# Altium schematic sheet Buck Converter.SchDoc
size A; SheetNumber: 4; SheetTotal: 5
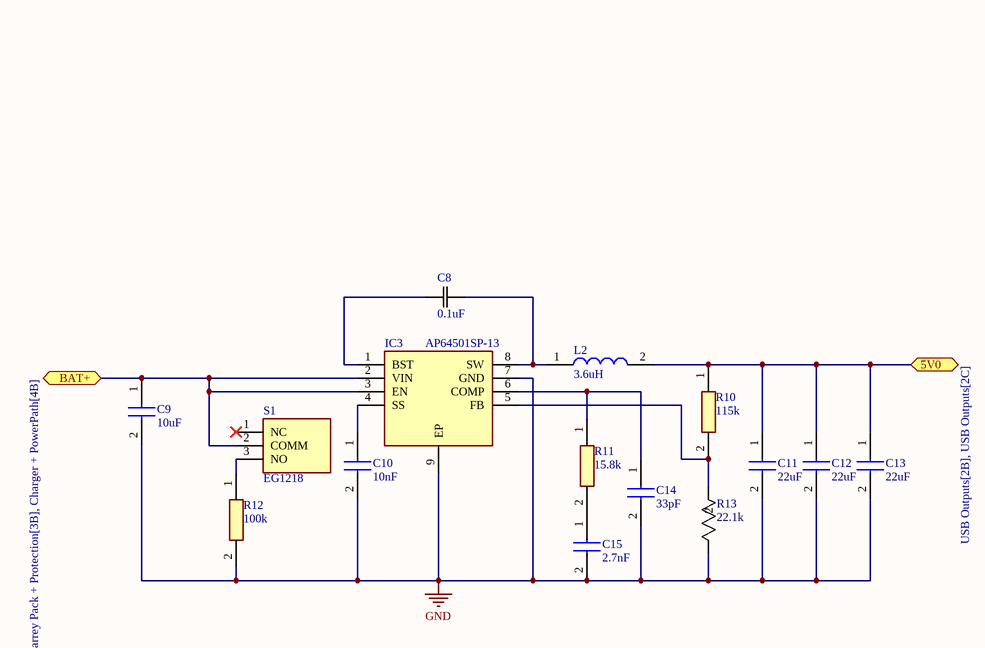
[diagram p0: Buck Converter.SchDoc]

## Parts
C8  0.1uF  [CAPC220145_88N_KEM]
C9  10uF  [CAPC3225X280N]
C10  10nF  [CAPC2012X88N]
C11  22uF  [C1210]
C12  22uF  [C1210]
C13  22uF  [C1210]
C14  33pF  [CAPC2012X70N]
C15  2.7nF  [C0805]
IC3  AP64501SP-13  [SOIC127P600X163-9N]
L2  3.6uH  [7447797360]
R10  115k  [RESC2012X60N]
R11  15.8k  [RESC2012X60N]
R12  100k  [RESC2012X60N]
R13  22.1k  [RC0805N_YAG]
S1  EG1218  [EG1218]

## Ports
5V0 (bidir, see USB Outputs[2B], USB Outputs[2C]), BAT+ (bidir, see Barrey Pack + Protection[3B], Charger + PowerPath[4B])

## Nets
GND: C9.2 C10.2 C11.2 C12.2 C13.2 C14.2 C15.2 IC3.7(GND) IC3.9(EP) R12.2 R13.1
5V0: C11.1 C12.1 C13.1 L2.2 R10.1 ; port 5V0
BAT+: C9.1 IC3.2(VIN) IC3.3(EN) S1.2(COMM) ; port BAT+
NetC8_1: C8.1 IC3.8(SW) L2.1
NetC8_2: C8.2 IC3.1(BST)
NetC10_1: C10.1 IC3.4(SS)
NetC14_1: C14.1 IC3.6(COMP) R11.1
NetC15_1: C15.1 R11.2
NetIC3_5: IC3.5(FB) R10.2 R13.2
NetR12_1: R12.1 S1.3(NO)

Not connected (* = marked no-connect by the designer): S1 1(NC)*

## Library data of the parts
C8 = C0805C104K5RACTU: SMD Comm X7R, Ceramic, 0.1 uF, 10%, 50 VDC, X7R, SMD, MLCC, Temperature Stable, Class II, 0805; Manufacturer_Name: Kemet; Copyright: Copyright (C) 2025 Ultra Librarian. All rights reserved.; Manufacturer_Part_Number: C0805C104K5RACTU
C9 = UMJ325KB7106KMHP: Capacitor; Manufacturer_Name: TAIYO YUDEN; Datasheet Link: https://www.mouser.com/datasheet/2/396/taiyo_yuden_12132018_mlcc11_hq_e-1510082.pdf; Height: 2.8mm; Manufacturer_Part_Number: UMJ325KB7106KMHP; Mouser Part Number: 963-UMJ325KB7106KMHP; Mouser Price/Stock: https://www.mouser.co.uk/ProductDetail/TAIYO-YUDEN/UMJ325KB7106KMHP?qs=sBf%2Fb4nBSld9dXe3Wmrcww%3D%3D
C10 = C0805C103KAREC7210: Capacitor; Manufacturer_Name: KEMET; Datasheet Link: https://content.kemet.com/datasheets/KEM_C1090_X7R_ESD.pdf; Height: 0.88mm; Manufacturer_Part_Number: C0805C103KAREC7210; Mouser Part Number: 80-C0805C103KARECLR; Mouser Price/Stock: https://www.mouser.co.uk/ProductDetail/KEMET/C0805C103KAREC7210?qs=55YtniHzbhA9BJ2p2brEAA%3D%3D
C11-C13 = C1210C226K4RACTU: Capacitor; Manufacturer_Name: KEMET; Datasheet Link: https://content.kemet.com/datasheets/KEM_C1002_X7R_SMD.pdf; Manufacturer_Part_Number: C1210C226K4RACTU; Mouser Part Number: 80-C1210C226K4RACTU; Mouser Price/Stock: https://www.mouser.co.uk/ProductDetail/KEMET/C1210C226K4RACTU?qs=sxHCE4x4v6aAPDKYEWh4OQ%3D%3D; Arrow Part Number: C1210C226K4RACTU; Arrow Price/Stock: https://www.arrow.com/en/products/c1210c226k4ractu/kemet-corporation
C14 = VJ0805A330FXBPW1BC: Capacitor; Manufacturer_Name: Vishay; Datasheet Link: https://componentsearchengine.com/Datasheets/1/VJ0805A330FXBPW1BC.pdf; Height: 0.7mm; Manufacturer_Part_Number: VJ0805A330FXBPW1BC; Mouser Part Number: 77-VJ0805A330FXBPBC; Mouser Price/Stock: https://www.mouser.com/Search/Refine.aspx?Keyword=77-VJ0805A330FXBPBC
C15 = C0805C272J5GACTU: Capacitor; Manufacturer_Name: KEMET; Datasheet Link: https://content.kemet.com/datasheets/KEM_C1003_C0G_SMD.pdf; Height: 1.1mm; Manufacturer_Part_Number: C0805C272J5GACTU; Mouser Part Number: 80-C0805C272J5GACTU; Mouser Price/Stock: https://www.mouser.co.uk/ProductDetail/KEMET/C0805C272J5GACTU?qs=tQYgeJ5sXdnrALuy0kZT2Q%3D%3D
IC3 = AP64501SP-13: Integrated Circuit; Manufacturer_Name: Diodes Incorporated; Datasheet Link: https://www.diodes.com//assets/Datasheets/AP64501.pdf; Height: 1.63mm; Manufacturer_Part_Number: AP64501SP-13; Mouser Part Number: 621-AP64501SP-13; Mouser Price/Stock: https://www.mouser.co.uk/ProductDetail/Diodes-Incorporated/AP64501SP-13?qs=P1JMDcb91o7FS0GU%252BW7TIQ%3D%3D; Arrow Part Number: AP64501SP-13; Arrow Price/Stock: https://www.arrow.com/en/products/ap64501sp-13/diodes-incorporated?utm_currency=USD&region=nac
L2 = 7447797360: Inductor; Manufacturer_Name: Wurth Elektronik; Datasheet Link: https://www.we-online.com/catalog/datasheet/7447797360.pdf; Height: 6.1mm; Manufacturer_Part_Number: 7447797360; Mouser Part Number: 710-7447797360; Mouser Price/Stock: https://www.mouser.co.uk/ProductDetail/Wurth-Elektronik/7447797360?qs=2kOmHSv6VfRmQPiKFu4rqg%3D%3D
R10 = AC0805FR-07115KL: Resistor; Manufacturer_Name: KEMET; Datasheet Link: https://www.yageo.com/upload/media/product/productsearch/datasheet/rchip/PYu-AC_51_RoHS_L_8.pdf; Height: 0.6mm; Manufacturer_Part_Number: AC0805FR-07115KL; Mouser Part Number: 603-AC0805FR-07115KL; Mouser Price/Stock: https://www.mouser.co.uk/ProductDetail/Yageo/AC0805FR-07115KL?qs=UBLIud9aIG1IFcDwGFdMOw%3D%3D
R11 = RC0805FR-0715K8L: Resistor; Manufacturer_Name: KEMET; Datasheet Link: http://www.yageo.com/documents/recent/PYu-RC_Group_51_RoHS_L_10.pdf; Height: 0.6mm; Manufacturer_Part_Number: RC0805FR-0715K8L; Mouser Part Number: 603-RC0805FR-0715K8L; Mouser Price/Stock: https://www.mouser.co.uk/ProductDetail/Yageo/RC0805FR-0715K8L/?qs=I9s6%2Fg9G0vu77HcX9Y4n3w%3D%3D; Arrow Part Number: RC0805FR-0715K8L; Arrow Price/Stock: https://www.arrow.com/en/products/rc0805fr-0715k8l/yageo
R12 = CHV0805-FX-1003ELF: Resistor; Manufacturer_Name: Bourns; Datasheet Link: https://www.bourns.com/docs/product-datasheets/chv.pdf; Height: 0.6mm; Manufacturer_Part_Number: CHV0805-FX-1003ELF; Arrow Part Number: CHV0805-FX-1003ELF; Arrow Price/Stock: https://www.arrow.com/en/products/chv0805-fx-1003elf/bourns
R13 = RC0805FR-0722K1L: Description; Manufacturer_Name: Yageo; Copyright: Copyright (C) 2025 Ultra Librarian. All rights reserved.; Manufacturer_Part_Number: RC0805FR-0722K1L
S1 = EG1218: Switch; Manufacturer_Name: E-Switch; Datasheet Link: https://configured-product-images.s3.amazonaws.com/2D/specs/EG1218.pdf; Height: 7.4mm; Manufacturer_Part_Number: EG1218; Mouser Part Number: 612-EG1218; Mouser Price/Stock: https://www.mouser.co.uk/ProductDetail/E-Switch/EG1218?qs=xDsBkp9LkocT0c8K%252B5e%2FgA%3D%3D